# EAGLE schematic flight_controller_v1.0 (EAGLE 9.7.0)

## Sheet 1 of 6: Power regulation
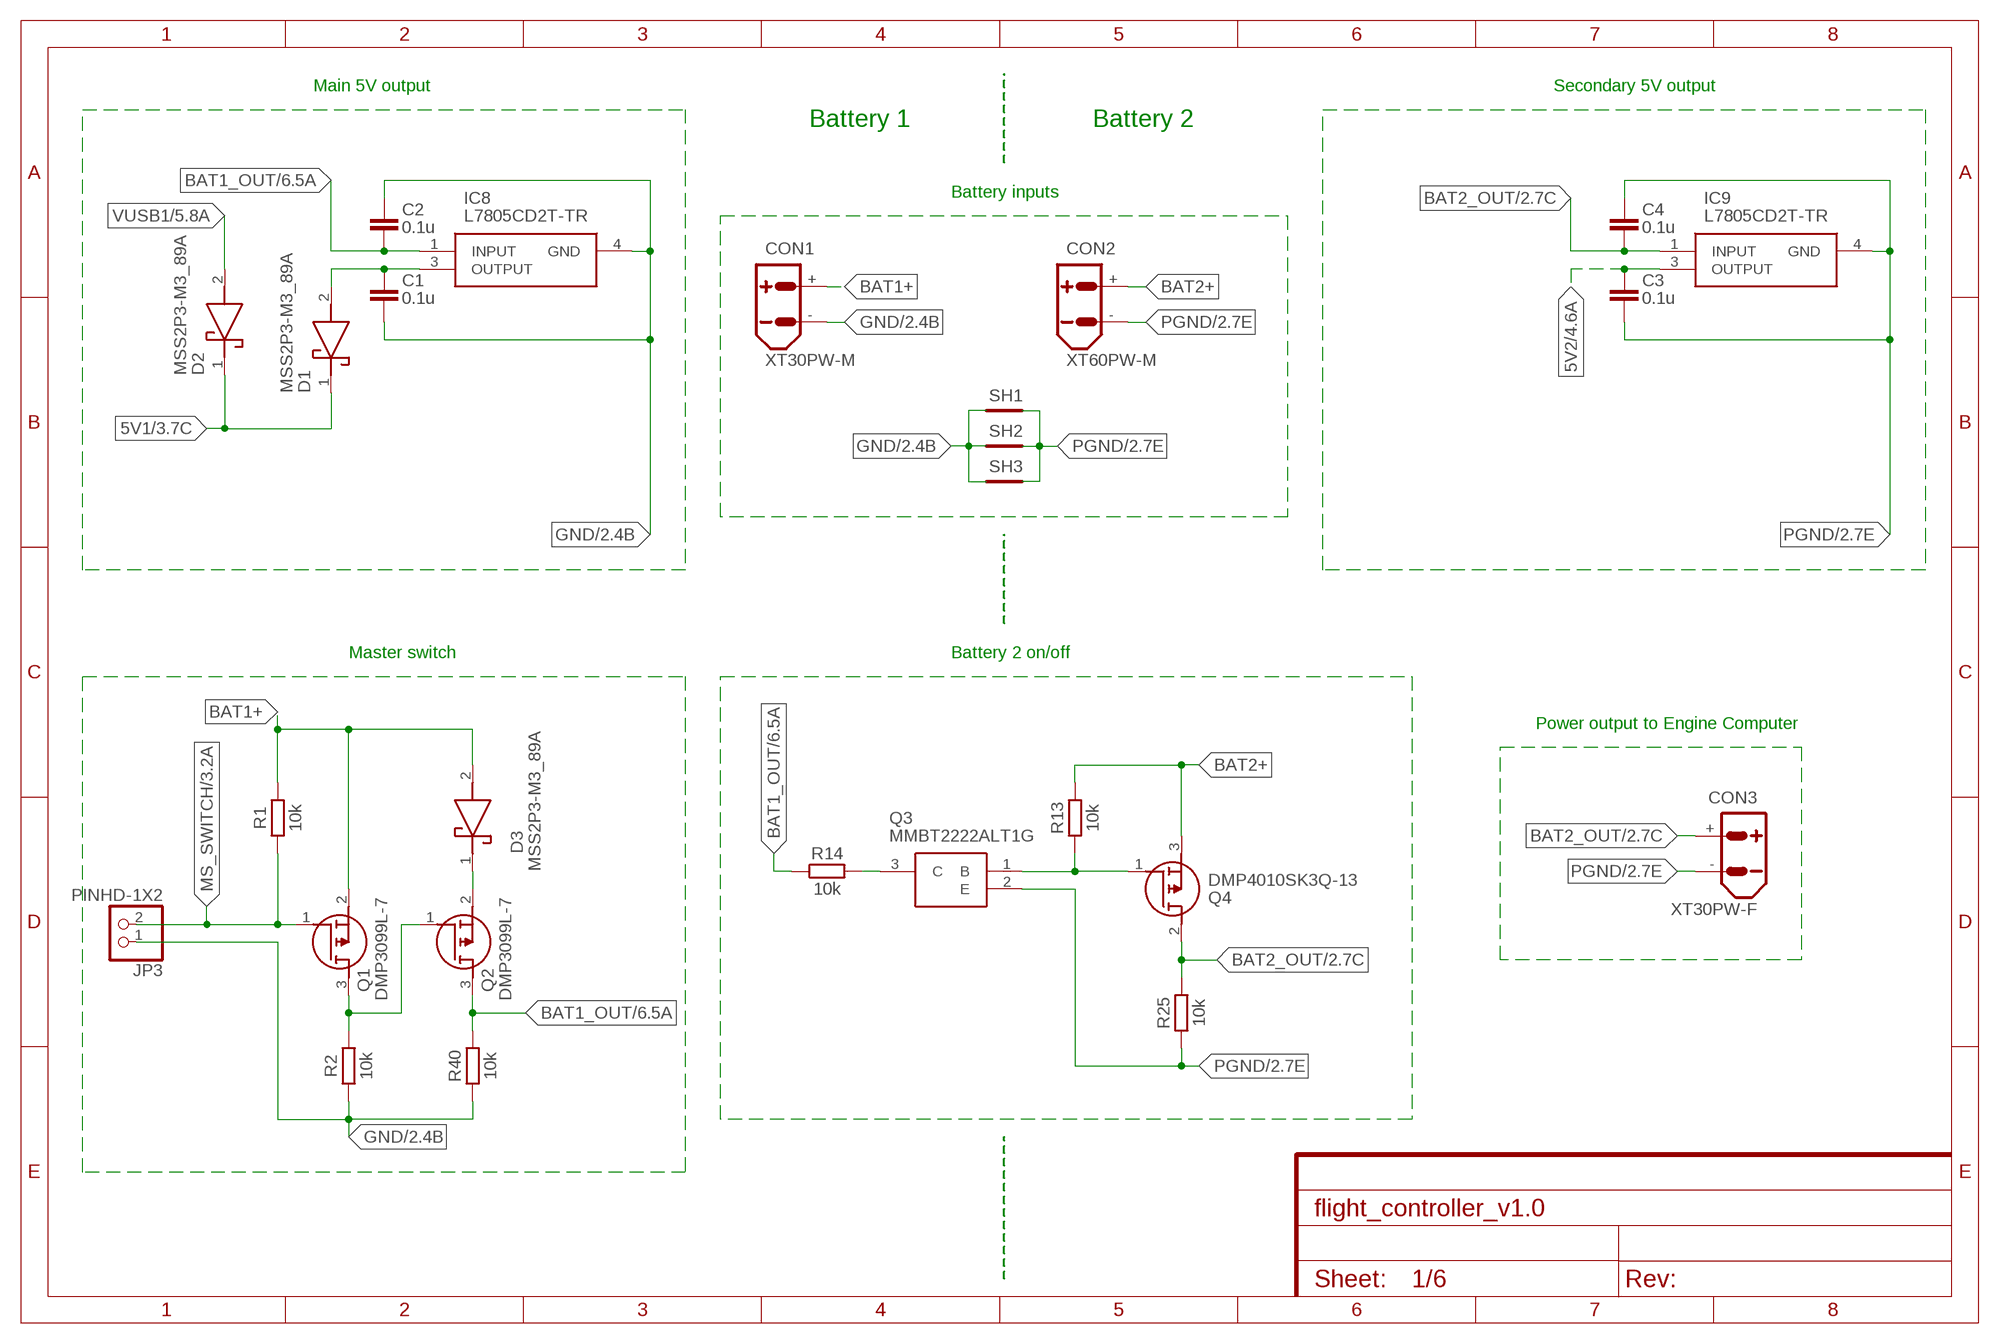
[diagram p0: schematic, sheet 1]

### Parts
C1  0.1u  C_CHIP-0805(2012-METRIC)  [CAPC2012X110]
C2  0.1u  C_CHIP-0805(2012-METRIC)  [CAPC2012X110]
C3  0.1u  C_CHIP-0805(2012-METRIC)  [CAPC2012X110]
C4  0.1u  C_CHIP-0805(2012-METRIC)  [CAPC2012X110]
CON1  XT30PW-M  [XT30PW-M]
CON2  XT60PW-M  [XT60PW-M]
CON3  XT30PW-F  [XT30PW-F]
D1  MSS2P3-M3_89A  [MSS2P3M389A]
D2  MSS2P3-M3_89A  [MSS2P3M389A]
D3  MSS2P3-M3_89A  [MSS2P3M389A]
IC8  L7805CD2T-TR  [TO254P1542X460-3N]
IC9  L7805CD2T-TR  [TO254P1542X460-3N]
JP3  PINHD-1X2  [1X02]
Q1  DMP3099L-7  [SOT96P240X120-3N]
Q2  DMP3099L-7  [SOT96P240X120-3N]
Q3  MMBT2222ALT1G  [SOT96P237X111-3N]
Q4  DMP4010SK3Q-13  [SBR6100CTL13]
R1  10k  R_CHIP-0805(2012-METRIC)  [RESC2012X65]
R2  10k  R_CHIP-0805(2012-METRIC)  [RESC2012X65]
R13  10k  R_CHIP-0805(2012-METRIC)  [RESC2012X65]
R14  10k  R_CHIP-0805(2012-METRIC)  [RESC2012X65]
R25  10k  R_CHIP-0805(2012-METRIC)  [RESC2012X65]
R40  10k  R_CHIP-0805(2012-METRIC)  [RESC2012X65]
SH1  SHORT-HT5  [SHORT_TOP-50]
SH2  SHORT-HT5  [SHORT_TOP-50]
SH3  SHORT-HT5  [SHORT_TOP-50]

### Nets
5V1: D1.1(K) D2.1(K) ; also sheet 3,5,6
5V2: C3.1 IC9.3(OUTPUT) ; also sheet 4,5
BAT1+: CON1.+ D3.2(A) Q1.2(S) R1.2
BAT1_OUT: C2.2 IC8.1(INPUT) Q2.3(D) R14.1 R40.2 ; also sheet 6
BAT2+: CON2.+ Q4.3(S) R13.2
BAT2_OUT: C4.2 CON3.+ IC9.1(INPUT) Q4.2(D) R25.2 ; also sheet 2,4,6
GND: C1.2 C2.1 CON1.- IC8.4(GND) JP3.1 R2.1 R40.1 SH1.1 SH2.1 SH3.1 ; also sheet 2,3,4,5,6
MS_SWITCH: JP3.2 Q1.1(G) R1.1 ; also sheet 3
N$6: Q1.3(D) Q2.1(G) R2.2
N$8: Q3.1(B) Q4.1(G) R13.1
N$19: Q3.3(C) R14.2
N$39: C1.1 D1.2(A) IC8.3(OUTPUT)
N$54: D3.1(K) Q2.2(S)
PGND: C3.2 C4.1 CON2.- CON3.- IC9.4(GND) Q3.2(E) R25.1 SH1.2 SH2.2 SH3.2 ; also sheet 2,4,5
VUSB1: D2.2(A) ; also sheet 5

### Notes on the sheet
- Main 5V output | Secondary 5V output
- Battery 1 | Battery 2
- Battery inputs
- Master switch | Battery 2 on/off
- Power output to Engine Computer

## Sheet 2 of 6: Parachute output
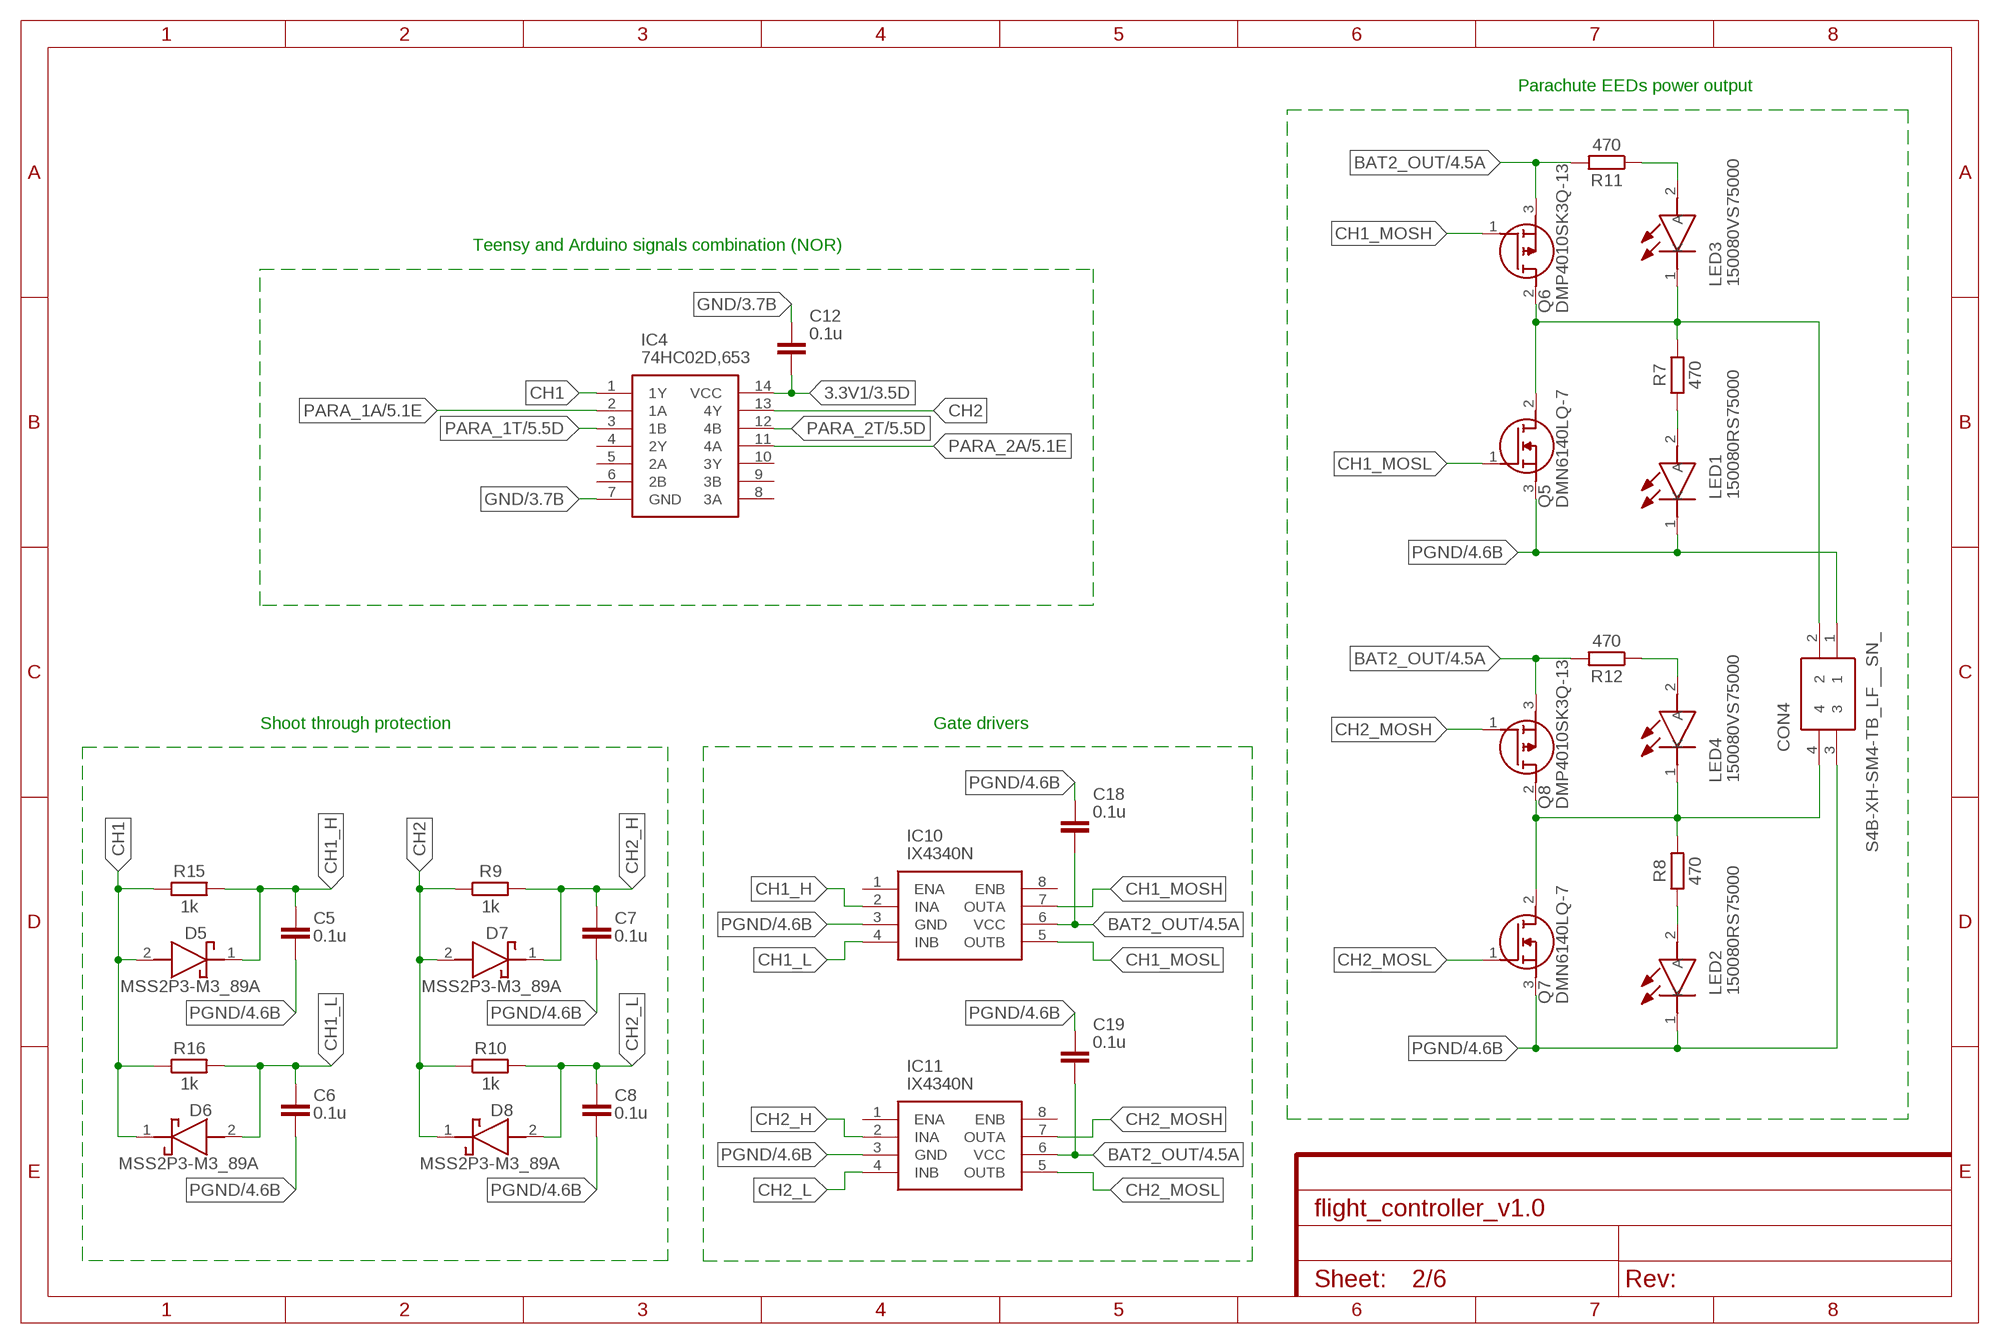
[diagram p1: schematic, sheet 2]

### Parts
C5  0.1u  C_CHIP-0805(2012-METRIC)  [CAPC2012X110]
C6  0.1u  C_CHIP-0805(2012-METRIC)  [CAPC2012X110]
C7  0.1u  C_CHIP-0805(2012-METRIC)  [CAPC2012X110]
C8  0.1u  C_CHIP-0805(2012-METRIC)  [CAPC2012X110]
C12  0.1u  C_CHIP-0805(2012-METRIC)  [CAPC2012X110]
C18  0.1u  C_CHIP-0805(2012-METRIC)  [CAPC2012X110]
C19  0.1u  C_CHIP-0805(2012-METRIC)  [CAPC2012X110]
CON4  S4B-XH-SM4-TB_LF__SN_  [S4B-XH-SM4-TB]
D5  MSS2P3-M3_89A  [MSS2P3M389A]
D6  MSS2P3-M3_89A  [MSS2P3M389A]
D7  MSS2P3-M3_89A  [MSS2P3M389A]
D8  MSS2P3-M3_89A  [MSS2P3M389A]
IC4  74HC02D,653  [SOIC127P600X175-14N]
IC10  IX4340N  [SOIC127P600X175-8N]
IC11  IX4340N  [SOIC127P600X175-8N]
LED1  150080RS75000  [LEDC2012X80N]
LED2  150080RS75000  [LEDC2012X80N]
LED3  150080VS75000  [LEDC2012X80N]
LED4  150080VS75000  [LEDC2012X80N]
Q5  DMN6140LQ-7  [SOT96P240X110-3N]
Q6  DMP4010SK3Q-13  [SBR6100CTL13]
Q7  DMN6140LQ-7  [SOT96P240X110-3N]
Q8  DMP4010SK3Q-13  [SBR6100CTL13]
R7  470  R_CHIP-0805(2012-METRIC)  [RESC2012X65]
R8  470  R_CHIP-0805(2012-METRIC)  [RESC2012X65]
R9  1k  R_CHIP-0805(2012-METRIC)  [RESC2012X65]
R10  1k  R_CHIP-0805(2012-METRIC)  [RESC2012X65]
R11  470  R_CHIP-0805(2012-METRIC)  [RESC2012X65]
R12  470  R_CHIP-0805(2012-METRIC)  [RESC2012X65]
R15  1k  R_CHIP-0805(2012-METRIC)  [RESC2012X65]
R16  1k  R_CHIP-0805(2012-METRIC)  [RESC2012X65]

### Nets
3.3V1: C12.2 IC4.14(VCC) ; also sheet 3,4,5,6
BAT2_OUT: C18.2 C19.2 IC10.6(VCC) IC11.6(VCC) Q6.3(S) Q8.3(S) R11.2 R12.2 ; also sheet 1,4,6
CH1: D5.2(A) D6.1(K) IC4.1(1Y) R15.1 R16.1
CH1_H: C5.1 D5.1(K) IC10.2(INA) R15.2
CH1_L: C6.1 D6.2(A) IC10.4(INB) R16.2
CH1_MOSH: IC10.7(OUTA) Q6.1(G)
CH1_MOSL: IC10.5(OUTB) Q5.1(G)
CH2: D7.2(A) D8.1(K) IC4.13(4Y) R9.1 R10.1
CH2_H: C7.1 D7.1(K) IC11.2(INA) R9.2
CH2_L: C8.1 D8.2(A) IC11.4(INB) R10.2
CH2_MOSH: IC11.7(OUTA) Q8.1(G)
CH2_MOSL: IC11.5(OUTB) Q7.1(G)
GND: C12.1 IC4.7(GND) ; also sheet 1,3,4,5,6
N$10: CON4.2 LED3.1(K) Q5.2(D) Q6.2(D) R7.2
N$11: LED1.2(A) R7.1
N$14: CON4.4 LED4.1(K) Q7.2(D) Q8.2(D) R8.2
N$16: LED2.2(A) R8.1
N$26: LED3.2(A) R11.1
N$28: LED4.2(A) R12.1
PARA_1A: IC4.2(1A) ; also sheet 5
PARA_1T: IC4.3(1B) ; also sheet 5
PARA_2A: IC4.11(4A) ; also sheet 5
PARA_2T: IC4.12(4B) ; also sheet 5
PGND: C5.2 C6.2 C7.2 C8.2 C18.1 C19.1 CON4.1 CON4.3 IC10.3(GND) IC11.3(GND) LED1.1(K) LED2.1(K) Q5.3(S) Q7.3(S) ; also sheet 1,4,5
Unconnected: IC4.4(2Y) IC4.5(2A) IC4.6(2B) IC4.8(3A) IC4.9(3B) IC4.10(3Y) IC10.1(ENA) IC10.8(ENB) IC11.1(ENA) IC11.8(ENB)

### Notes on the sheet
- Parachute EEDs power output
- Teensy and Arduino signals combination (NOR)
- Shoot through protection | Gate drivers

## Sheet 3 of 6: I/O connectors 1
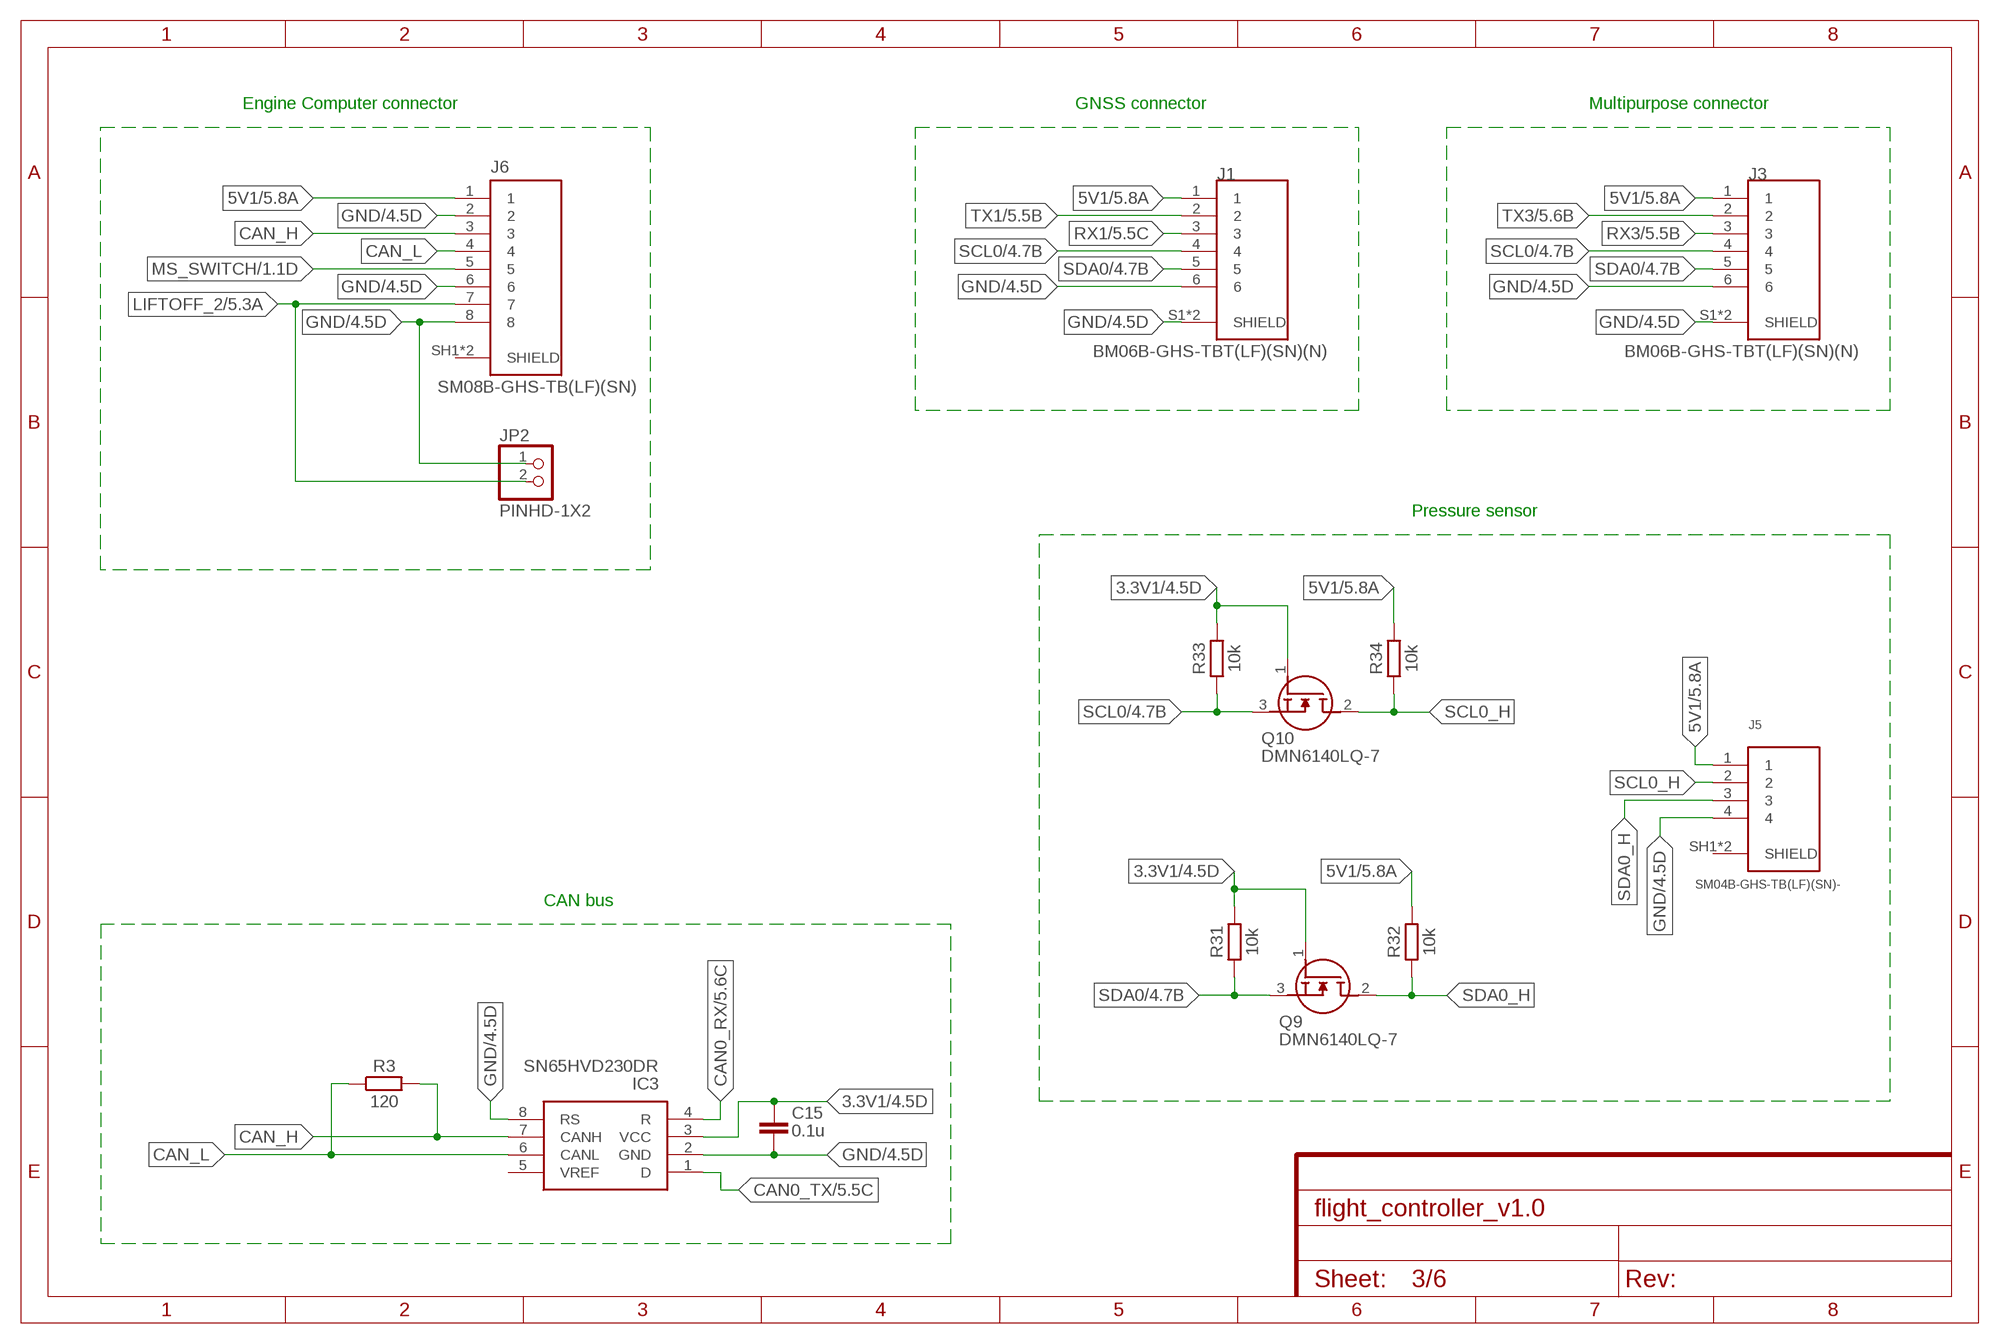
[diagram p2: schematic, sheet 3]

### Parts
C15  0.1u  C_CHIP-0805(2012-METRIC)  [CAPC2012X110]
IC3  SN65HVD230DR  [SOT127P600X175-8N]
J1  BM06B-GHS-TBT(LF)(SN)(N)  [JST_BM06B-GHS-TBT(LF)(SN)(N)]
J3  BM06B-GHS-TBT(LF)(SN)(N)  [JST_BM06B-GHS-TBT(LF)(SN)(N)]
J5  SM04B-GHS-TB(LF)(SN)-  [JST_SM04B-GHS-TB(LF)(SN)-]
J6  SM08B-GHS-TB(LF)(SN)  [JST_SM08B-GHS-TB(LF)(SN)]
JP2  PINHD-1X2  [1X02]
Q9  DMN6140LQ-7  [SOT96P240X110-3N]
Q10  DMN6140LQ-7  [SOT96P240X110-3N]
R3  120  R_CHIP-0805(2012-METRIC)  [RESC2012X65]
R31  10k  R_CHIP-0805(2012-METRIC)  [RESC2012X65]
R32  10k  R_CHIP-0805(2012-METRIC)  [RESC2012X65]
R33  10k  R_CHIP-0805(2012-METRIC)  [RESC2012X65]
R34  10k  R_CHIP-0805(2012-METRIC)  [RESC2012X65]

### Nets
3.3V1: C15.1 IC3.3(VCC) Q9.1(G) Q10.1(G) R31.2 R33.2 ; also sheet 2,4,5,6
5V1: J1.1 J3.1 J5.1 J6.1 R32.2 R34.2 ; also sheet 1,5,6
CAN0_RX: IC3.4(R) ; also sheet 5
CAN0_TX: IC3.1(D) ; also sheet 5
CAN_H: IC3.7(CANH) J6.3 R3.2
CAN_L: IC3.6(CANL) J6.4 R3.1
GND: C15.2 IC3.2(GND) IC3.8(RS) J1.6 J1.S1(SHIELD) J1.S2(SHIELD) J3.6 J3.S1(SHIELD) J3.S2(SHIELD) J5.4 J6.2 J6.6 J6.8 JP2.1 ; also sheet 1,2,4,5,6
LIFTOFF_2: J6.7 JP2.2 ; also sheet 5
MS_SWITCH: J6.5 ; also sheet 1
RX1: J1.3 ; also sheet 5
RX3: J3.3 ; also sheet 5
SCL0: J1.4 J3.4 Q10.3(S) R33.1 ; also sheet 4,5
SCL0_H: J5.2 Q10.2(D) R34.1
SDA0: J1.5 J3.5 Q9.3(S) R31.1 ; also sheet 4,5
SDA0_H: J5.3 Q9.2(D) R32.1
TX1: J1.2 ; also sheet 5
TX3: J3.2 ; also sheet 5
Unconnected: IC3.5(VREF) J6.SH1(SHIELD) J6.SH2(SHIELD)

### Notes on the sheet
- Engine Computer connector | GNSS connector | Multipurpose connector
- Pressure sensor
- CAN bus

## Sheet 4 of 6: I/O connectors 2
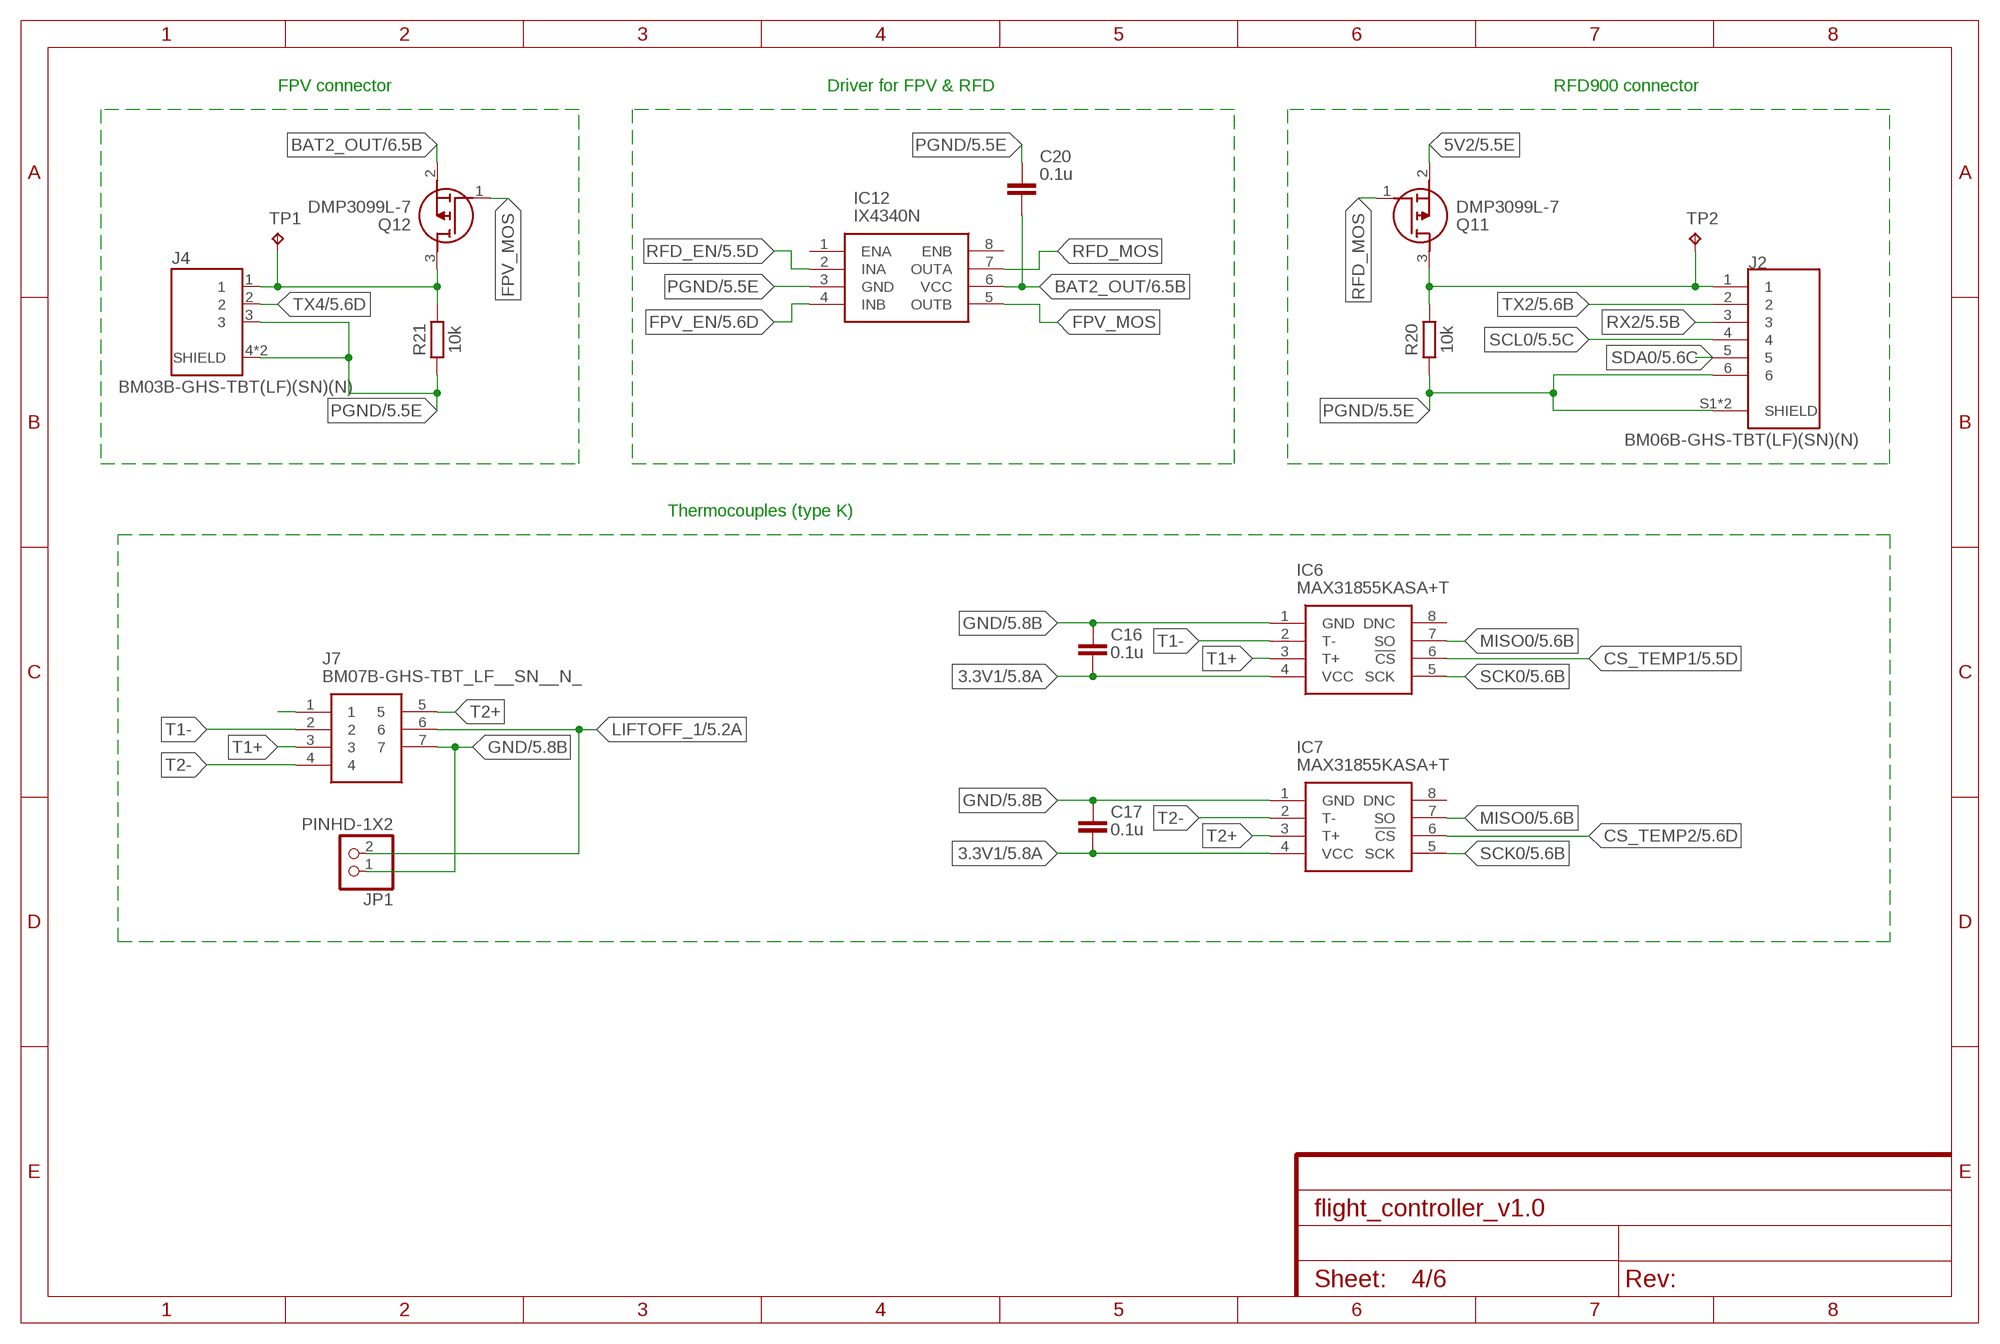
[diagram p3: schematic, sheet 4]

### Parts
C16  0.1u  C_CHIP-0805(2012-METRIC)  [CAPC2012X110]
C17  0.1u  C_CHIP-0805(2012-METRIC)  [CAPC2012X110]
C20  0.1u  C_CHIP-0805(2012-METRIC)  [CAPC2012X110]
IC6  MAX31855KASA+T  [SOIC127P600X175-8N]
IC7  MAX31855KASA+T  [SOIC127P600X175-8N]
IC12  IX4340N  [SOIC127P600X175-8N]
J2  BM06B-GHS-TBT(LF)(SN)(N)  [JST_BM06B-GHS-TBT(LF)(SN)(N)]
J4  BM03B-GHS-TBT(LF)(SN)(N)  [CONN_BM03B-GHS-TBT(LF)(SN)(N)]
J7  BM07B-GHS-TBT_LF__SN__N_  [BM07B-GHS-TBT]
JP1  PINHD-1X2  [1X02]
Q11  DMP3099L-7  [SOT96P240X120-3N]
Q12  DMP3099L-7  [SOT96P240X120-3N]
R20  10k  R_CHIP-0805(2012-METRIC)  [RESC2012X65]
R21  10k  R_CHIP-0805(2012-METRIC)  [RESC2012X65]
TP1  TPB1,27  [B1,27]
TP2  TPB1,27  [B1,27]

### Nets
3.3V1: C16.2 C17.2 IC6.4(VCC) IC7.4(VCC) ; also sheet 2,3,5,6
5V2: Q11.2(S) ; also sheet 1,5
BAT2_OUT: C20.2 IC12.6(VCC) Q12.2(S) ; also sheet 1,2,6
CS_TEMP1: IC6.6(!CS) ; also sheet 5
CS_TEMP2: IC7.6(!CS) ; also sheet 5
FPV_EN: IC12.4(INB) ; also sheet 5
FPV_MOS: IC12.5(OUTB) Q12.1(G)
GND: C16.1 C17.1 IC6.1(GND) IC7.1(GND) J7.7 JP1.1 ; also sheet 1,2,3,5,6
LIFTOFF_1: J7.6 JP1.2 ; also sheet 5
MISO0: IC6.7(SO) IC7.7(SO) ; also sheet 5,6
N$32: J2.1 Q11.3(D) R20.2 TP2.TP
N$35: J4.1 Q12.3(D) R21.2 TP1.TP
N$42: J7.1
PGND: C20.1 IC12.3(GND) J2.6 J2.S1(SHIELD) J2.S2(SHIELD) J4.3 J4.4(SHIELD) J4.5(SHIELD) R20.1 R21.1 ; also sheet 1,2,5
RFD_EN: IC12.2(INA) ; also sheet 5
RFD_MOS: IC12.7(OUTA) Q11.1(G)
RX2: J2.3 ; also sheet 5
SCK0: IC6.5(SCK) IC7.5(SCK) ; also sheet 5,6
SCL0: J2.4 ; also sheet 3,5
SDA0: J2.5 ; also sheet 3,5
T1+: IC6.3(T+) J7.3
T1-: IC6.2(T-) J7.2
T2+: IC7.3(T+) J7.5
T2-: IC7.2(T-) J7.4
TX2: J2.2 ; also sheet 5
TX4: J4.2 ; also sheet 5
Unconnected: IC6.8(DNC) IC7.8(DNC) IC12.1(ENA) IC12.8(ENB)

### Notes on the sheet
- FPV connector | Driver for FPV & RFD | RFD900 connector
- Thermocouples (type K)

## Sheet 5 of 6: MCUs
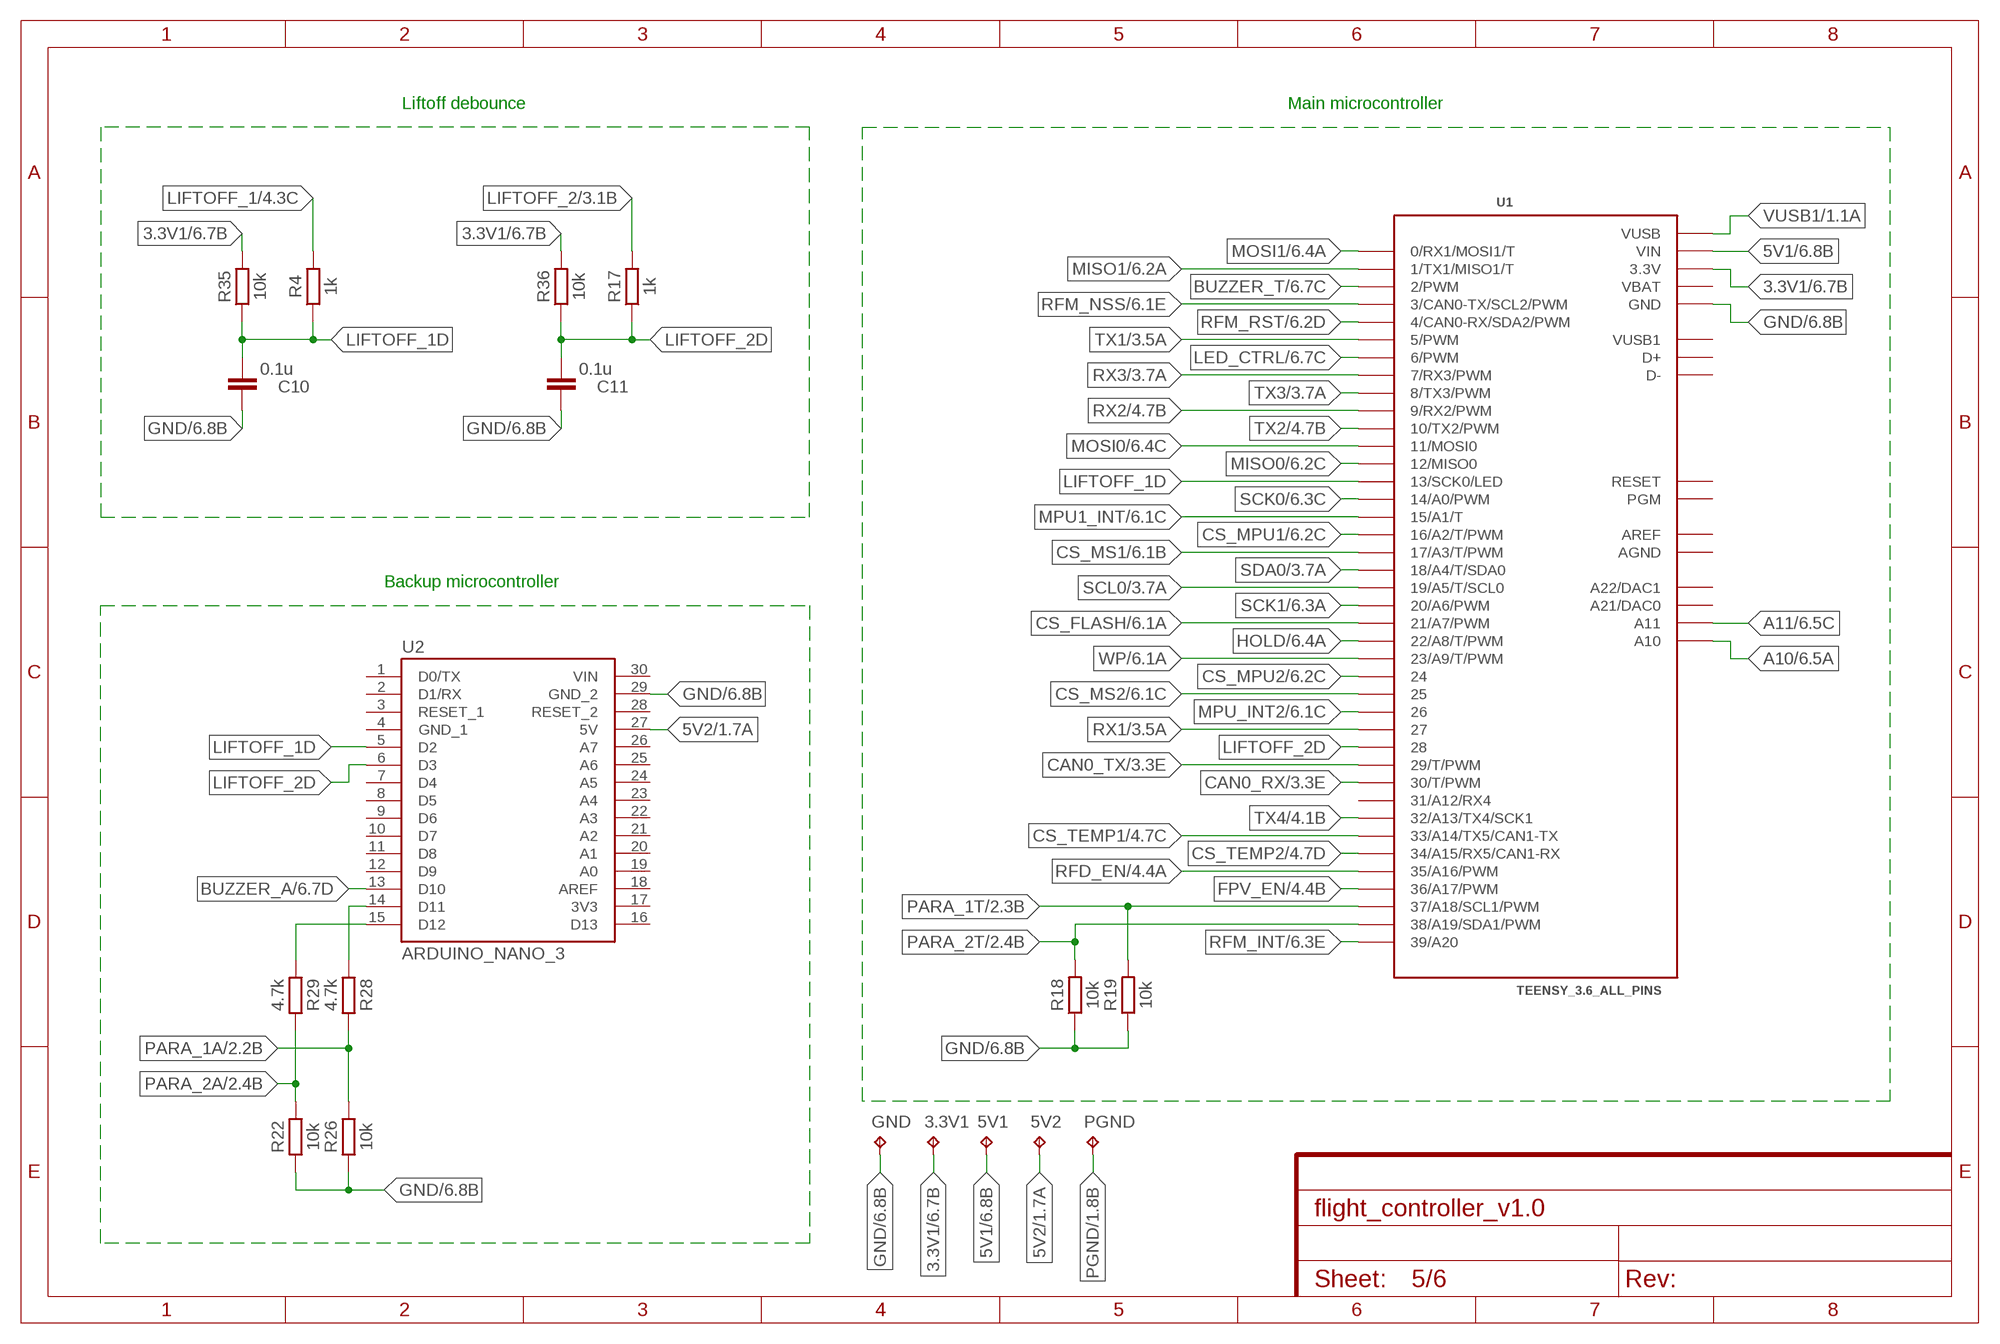
[diagram p4: schematic, sheet 5]

### Parts
3.3V1  TPB1,27  [B1,27]
5V1  TPB1,27  [B1,27]
5V2  TPB1,27  [B1,27]
C10  0.1u  C_CHIP-0805(2012-METRIC)  [CAPC2012X110]
C11  0.1u  C_CHIP-0805(2012-METRIC)  [CAPC2012X110]
GND  TPB1,27  [B1,27]
PGND  TPB1,27  [B1,27]
R4  1k  R_CHIP-0805(2012-METRIC)  [RESC2012X65]
R17  1k  R_CHIP-0805(2012-METRIC)  [RESC2012X65]
R18  10k  R_CHIP-0805(2012-METRIC)  [RESC2012X65]
R19  10k  R_CHIP-0805(2012-METRIC)  [RESC2012X65]
R22  10k  R_CHIP-0805(2012-METRIC)  [RESC2012X65]
R26  10k  R_CHIP-0805(2012-METRIC)  [RESC2012X65]
R28  4.7k  R_CHIP-0805(2012-METRIC)  [RESC2012X65]
R29  4.7k  R_CHIP-0805(2012-METRIC)  [RESC2012X65]
R35  10k  R_CHIP-0805(2012-METRIC)  [RESC2012X65]
R36  10k  R_CHIP-0805(2012-METRIC)  [RESC2012X65]
U1  TEENSY_3.6_ALL_PINS  [TEENSY_3.6_ALL_PINS]
U2  ARDUINO_NANO_3  [MODULE_A000005]

### Nets
3.3V1: 3.3V1.TP R35.2 R36.2 U1.3.3V U1.3.3V3(3.3V) U1.3.3V4(3.3V) ; also sheet 2,3,4,6
5V1: 5V1.TP U1.VIN ; also sheet 1,3,6
5V2: 5V2.TP U2.27(5V) ; also sheet 1,4
A10: U1.A10 ; also sheet 6
A11: U1.A11 ; also sheet 6
BUZZER_A: U2.13(D10) ; also sheet 6
BUZZER_T: U1.2(2/PWM) ; also sheet 6
CAN0_RX: U1.30(30/T/PWM) ; also sheet 3
CAN0_TX: U1.29(29/T/PWM) ; also sheet 3
CS_FLASH: U1.21/A7(21/A7/PWM) ; also sheet 6
CS_MPU1: U1.16/A2(16/A2/T/PWM) ; also sheet 6
CS_MPU2: U1.24 ; also sheet 6
CS_MS1: U1.17/A3(17/A3/T/PWM) ; also sheet 6
CS_MS2: U1.25 ; also sheet 6
CS_TEMP1: U1.33/A14(33/A14/TX5/CAN1-TX) ; also sheet 4
CS_TEMP2: U1.34/A15(34/A15/RX5/CAN1-RX) ; also sheet 4
FPV_EN: U1.36/A17(36/A17/PWM) ; also sheet 4
GND: C10.2 C11.2 GND.TP R18.1 R19.1 R22.1 R26.1 U1.GND U1.GND1(GND) U1.GND3(GND) U1.GND4(GND) U1.GND6(GND) U2.29(GND_2) ; also sheet 1,2,3,4,6
HOLD: U1.22/A8(22/A8/T/PWM) ; also sheet 6
LED_CTRL: U1.6(6/PWM) ; also sheet 6
LIFTOFF_1: R4.2 ; also sheet 4
LIFTOFF_1D: C10.1 R4.1 R35.1 U1.13(13/SCK0/LED) U2.5(D2)
LIFTOFF_2: R17.2 ; also sheet 3
LIFTOFF_2D: C11.1 R17.1 R36.1 U1.28 U2.6(D3)
MISO0: U1.12(12/MISO0) ; also sheet 4,6
MISO1: U1.1(1/TX1/MISO1/T) ; also sheet 6
MOSI0: U1.11(11/MOSI0) ; also sheet 6
MOSI1: U1.0(0/RX1/MOSI1/T) ; also sheet 6
MPU1_INT: U1.15/A1(15/A1/T) ; also sheet 6
MPU_INT2: U1.26 ; also sheet 6
N$45: R28.1 U2.14(D11)
N$46: R29.1 U2.15(D12)
PARA_1A: R26.2 R28.2 ; also sheet 2
PARA_1T: R19.2 U1.37/A18(37/A18/SCL1/PWM) ; also sheet 2
PARA_2A: R22.2 R29.2 ; also sheet 2
PARA_2T: R18.2 U1.38/A19(38/A19/SDA1/PWM) ; also sheet 2
PGND: PGND.TP ; also sheet 1,2,4
RFD_EN: U1.35/A16(35/A16/PWM) ; also sheet 4
RFM_INT: U1.39/A20 ; also sheet 6
RFM_NSS: U1.3(3/CAN0-TX/SCL2/PWM) ; also sheet 6
RFM_RST: U1.4(4/CAN0-RX/SDA2/PWM) ; also sheet 6
RX1: U1.27 ; also sheet 3
RX2: U1.9(9/RX2/PWM) ; also sheet 4
RX3: U1.7(7/RX3/PWM) ; also sheet 3
SCK0: U1.14/A0(14/A0/PWM) ; also sheet 4,6
SCK1: U1.20/A6(20/A6/PWM) ; also sheet 6
SCL0: U1.19/A5(19/A5/T/SCL0) ; also sheet 3,4
SDA0: U1.18/A4(18/A4/T/SDA0) ; also sheet 3,4
TX1: U1.5(5/PWM) ; also sheet 3
TX2: U1.10(10/TX2/PWM) ; also sheet 4
TX3: U1.8(8/TX3/PWM) ; also sheet 3
TX4: U1.32/A13(32/A13/TX4/SCK1) ; also sheet 4
VUSB1: U1.VUSB ; also sheet 1
WP: U1.23/A9(23/A9/T/PWM) ; also sheet 6
Unconnected: U1.31/A12(31/A12/RX4) U1.A21(A21/DAC0) U1.A22(A22/DAC1) U1.D+ U1.D- U1.PGM U1.RESET U2.1(D0/TX) U2.2(D1/RX) U2.3(RESET_1) U2.7(D4) U2.8(D5) U2.9(D6) U2.10(D7) U2.11(D8) U2.12(D9) U2.16(D13) U2.18(AREF) U2.19(A0) U2.20(A1) U2.21(A2) U2.22(A3) U2.23(A4) U2.24(A5) U2.25(A6) U2.26(A7) U2.28(RESET_2)

### Notes on the sheet
- Liftoff debounce | Main microcontroller
- Backup microcontroller

## Sheet 6 of 6: RF, memory, on-board sensors
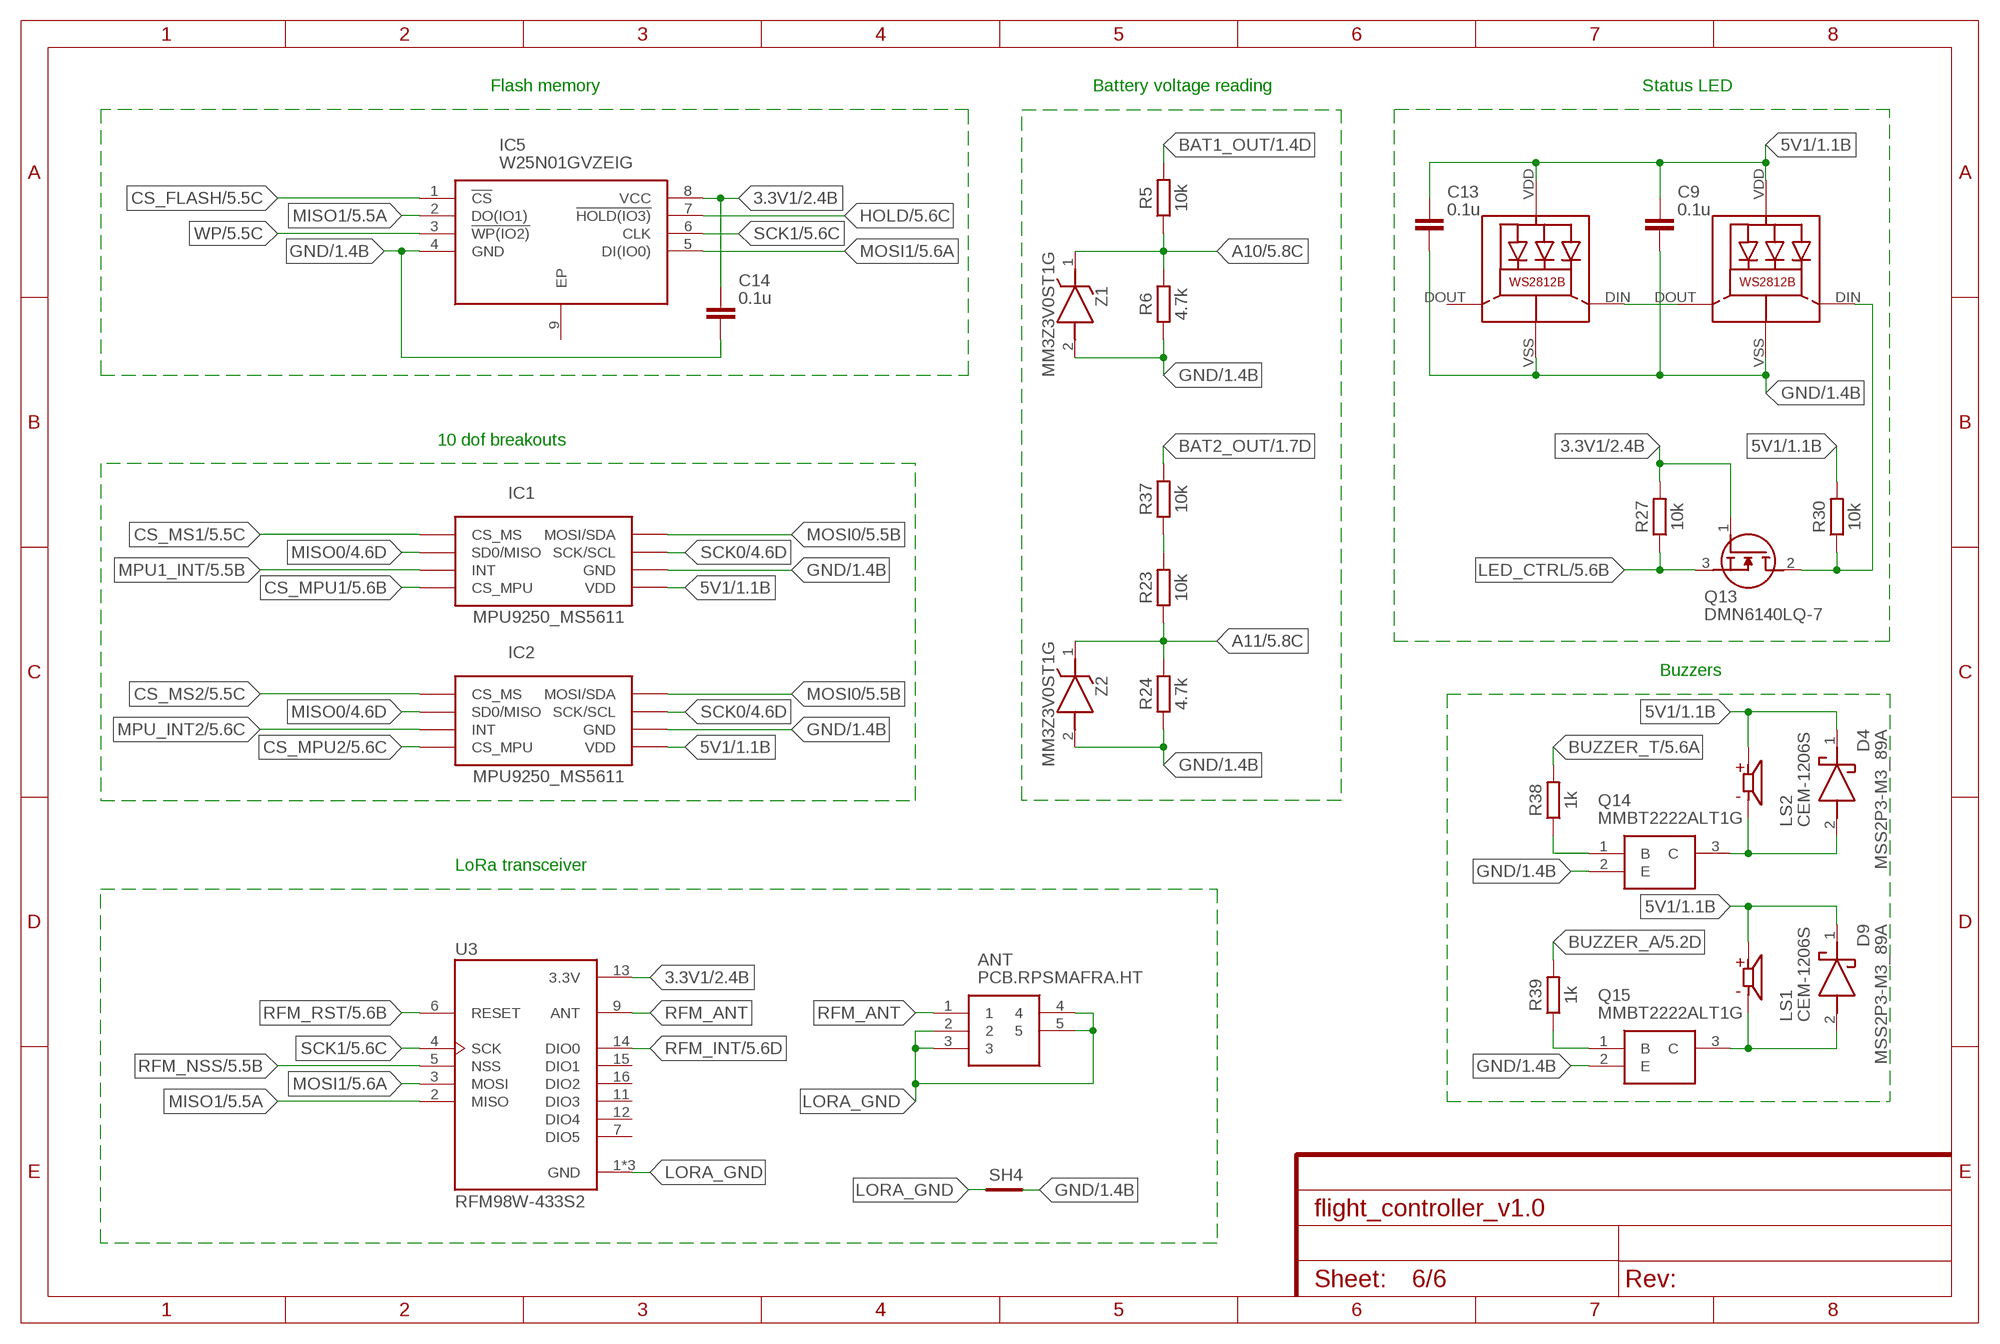
[diagram p5: schematic, sheet 6]

### Parts
ANT  PCB.RPSMAFRA.HT  [PCBRPSMAFRAHT]
C9  0.1u  C_CHIP-0805(2012-METRIC)  [CAPC2012X110]
C13  0.1u  C_CHIP-0805(2012-METRIC)  [CAPC2012X110]
C14  0.1u  C_CHIP-0805(2012-METRIC)  [CAPC2012X110]
D4  MSS2P3-M3_89A  [MSS2P3M389A]
D9  MSS2P3-M3_89A  [MSS2P3M389A]
IC1  MPU9250_MS5611  [2X4PIN]
IC2  MPU9250_MS5611  [2X4PIN]
IC5  W25N01GVZEIG  [SON127P800X600X80-9N]
LED5  WS2812B  [WS2812B]
LED6  WS2812B  [WS2812B]
LS1  CEM-1206S  [CUI_CEM-1206S]
LS2  CEM-1206S  [CUI_CEM-1206S]
Q13  DMN6140LQ-7  [SOT96P240X110-3N]
Q14  MMBT2222ALT1G  [SOT96P237X111-3N]
Q15  MMBT2222ALT1G  [SOT96P237X111-3N]
R5  10k  R_CHIP-0805(2012-METRIC)  [RESC2012X65]
R6  4.7k  R_CHIP-0805(2012-METRIC)  [RESC2012X65]
R23  10k  R_CHIP-0805(2012-METRIC)  [RESC2012X65]
R24  4.7k  R_CHIP-0805(2012-METRIC)  [RESC2012X65]
R27  10k  R_CHIP-0805(2012-METRIC)  [RESC2012X65]
R30  10k  R_CHIP-0805(2012-METRIC)  [RESC2012X65]
R37  10k  R_CHIP-0805(2012-METRIC)  [RESC2012X65]
R38  1k  R_CHIP-0805(2012-METRIC)  [RESC2012X65]
R39  1k  R_CHIP-0805(2012-METRIC)  [RESC2012X65]
SH4  SHORT-HT5  [SHORT_TOP-50]
U3  RFM98W-433S2  [XCVR_RFM98W-433S2]
Z1  MM3Z3V0ST1G  [SOD2512X110N]
Z2  MM3Z3V0ST1G  [SOD2512X110N]

### Nets
3.3V1: C14.1 IC5.8(VCC) Q13.1(G) R27.2 U3.13(3.3V) ; also sheet 2,3,4,5
5V1: C9.1 C13.1 D4.1(K) D9.1(K) IC1.P$5(VDD) IC2.P$5(VDD) LED5.VDD LED6.VDD LS1.P LS2.P R30.2 ; also sheet 1,3,5
A10: R5.1 R6.2 Z1.1(K) ; also sheet 5
A11: R23.1 R24.2 Z2.1(K) ; also sheet 5
BAT1_OUT: R5.2 ; also sheet 1
BAT2_OUT: R37.2 ; also sheet 1,2,4
BUZZER_A: R39.2 ; also sheet 5
BUZZER_T: R38.2 ; also sheet 5
CS_FLASH: IC5.1(!CS) ; also sheet 5
CS_MPU1: IC1.P$4(CS_MPU) ; also sheet 5
CS_MPU2: IC2.P$4(CS_MPU) ; also sheet 5
CS_MS1: IC1.P$1(CS_MS) ; also sheet 5
CS_MS2: IC2.P$1(CS_MS) ; also sheet 5
GND: C9.2 C13.2 C14.2 IC1.P$6(GND) IC2.P$6(GND) IC5.4(GND) LED5.VSS(GND) LED6.VSS(GND) Q14.2(E) Q15.2(E) R6.1 R24.1 SH4.2 Z1.2(A) Z2.2(A) ; also sheet 1,2,3,4,5
HOLD: IC5.7(!HOLD(IO3)) ; also sheet 5
LED_CTRL: Q13.3(S) R27.1 ; also sheet 5
LORA_GND: ANT.2 ANT.3 ANT.4 ANT.5 SH4.1 U3.1(GND) U3.8(GND) U3.10(GND)
MISO0: IC1.P$2(SD0/MISO) IC2.P$2(SD0/MISO) ; also sheet 4,5
MISO1: IC5.2(DO(IO1)) U3.2(MISO) ; also sheet 5
MOSI0: IC1.P$8(MOSI/SDA) IC2.P$8(MOSI/SDA) ; also sheet 5
MOSI1: IC5.5(DI(IO0)) U3.3(MOSI) ; also sheet 5
MPU1_INT: IC1.P$3(INT) ; also sheet 5
MPU_INT2: IC2.P$3(INT) ; also sheet 5
N$1: LED5.DOUT(DO) LED6.DIN(DI)
N$44: LED5.DIN(DI) Q13.2(D) R30.1
N$48: R23.2 R37.1
N$49: D4.2(A) LS2.N Q14.3(C)
N$50: Q14.1(B) R38.1
N$51: D9.2(A) LS1.N Q15.3(C)
N$52: Q15.1(B) R39.1
RFM_ANT: ANT.1 U3.9(ANT)
RFM_INT: U3.14(DIO0) ; also sheet 5
RFM_NSS: U3.5(NSS) ; also sheet 5
RFM_RST: U3.6(RESET) ; also sheet 5
SCK0: IC1.P$7(SCK/SCL) IC2.P$7(SCK/SCL) ; also sheet 4,5
SCK1: IC5.6(CLK) U3.4(SCK) ; also sheet 5
WP: IC5.3(!WP(IO2)) ; also sheet 5
Unconnected: IC5.9(EP) LED6.DOUT(DO) U3.7(DIO5) U3.11(DIO3) U3.12(DIO4) U3.15(DIO1) U3.16(DIO2)

### Notes on the sheet
- Flash memory | Battery voltage reading | Status LED
- 10 dof breakouts
- Buzzers
- LoRa transceiver

## Power pins joined to a net without a drawn wire
3V3: U2.17(3V3)
AGND: U1.AGND
AREF: U1.AREF
GND_1: U2.4(GND_1)
SHIELD: J5.SH1(SHIELD) J5.SH2(SHIELD)
VBAT: U1.VBAT
VIN: U2.30(VIN)
VUSB1: U1.VUSB1

## Library data of the parts
3.3V1 5V1 5V2 GND PGND TP1 TP2 = testpad:TP: Test pad
ANT = PCB.RPSMAFRA.HT:PCB.RPSMAFRA.HT: RF Connectors / Coaxial Connectors SMA RA Reverse Polarity PCB Mount, Jack, Gold, 50 , Through Hole Pin Source: Datasheet <http://www.taoglas.com/wp-content/uploads/2016/01/PCB.RPSMAFRA.HT_.pdf>; DESCRIPTION: RF Connectors / Coaxial Connectors SMA RA Reverse Polarity PCB Mount, Jack, Gold, 50 , Through Hole Pin; HEIGHT: 7.4mm; MANUFACTURER_NAME: Taoglas; MANUFACTURER_PART_NUMBER: PCB.RPSMAFRA.HT; MOUSER_PART_NUMBER: 960-PCB.RPSMAFRA.HT; MOUSER_PRICE-STOCK: https://www.mouser.co.uk/ProductDetail/Taoglas/PCBRPSMAFRAHT?qs=RuW%2Fu%252BNMQmvVc2WiXpnkVw%3D%3D
C1-C20 = Capacitor:C: Capacitor - Generic; CATEGORY: Capacitor
CON1 CON3 = Amass connectors:XT30: AMASS XT30 connector Store in Japan AMASS XT30 connector <https://szc.jp/ams-xt30>
CON2 = Amass connectors:XT60: AMASS XT60 connector Store in Japan AMASS XT60 connector <https://szc.jp/ams-xt60>
CON4 = S4B-XH-SM4-TB_LF__SN_:S4B-XH-SM4-TB_LF__SN_: XH connector, SMT type shrouded header, 4-position Source: Datasheet <http://www.jst-mfg.com/product/pdf/eng/eXH.pdf>; DESCRIPTION: XH connector, SMT type shrouded header, 4-position; HEIGHT: mm; MANUFACTURER_NAME: JST (JAPAN SOLDERLESS TERMINALS); MANUFACTURER_PART_NUMBER: S4B-XH-SM4-TB(LF)(SN)
D1-D9 = MSS2P3-M3_89A:MSS2P3-M3_89A: Surface Mount Diode Schottky 30V 2A Micro SMP Vishay MSS2P3-M3/89A, SMT Schottky Diode, 30V 2A, 2-Pin uSMP Source: Datasheet <https://componentsearchengine.com/Datasheets/1/MSS2P3-M3_89A.pdf>; DESCRIPTION: Surface Mount Diode Schottky 30V 2A Micro SMP Vishay MSS2P3-M3/89A, SMT Schottky Diode, 30V 2A, 2-Pin uSMP; HEIGHT: 0.73mm; MANUFACTURER_NAME: Vishay; MANUFACTURER_PART_NUMBER: MSS2P3-M3/89A; MOUSER_PART_NUMBER: 625-MSS2P3-M3; MOUSER_PRICE-STOCK: https://www.mouser.com/Search/Refine.aspx?Keyword=625-MSS2P3-M3
IC1 IC2 = MPU9250_MS5611:MPU9250_MS5611
IC3 = SN65HVD230DR:SN65HVD230DR: 3.3 V CAN Transceiver with Standby Mode Source: Datasheet <http://www.ti.com/lit/gpn/sn65hvd230>; DESCRIPTION: 3.3 V CAN Transceiver with Standby Mode; HEIGHT: 1.75mm; MANUFACTURER_NAME: Texas Instruments; MANUFACTURER_PART_NUMBER: SN65HVD230DR; MOUSER_PART_NUMBER: 595-SN65HVD230DR; MOUSER_PRICE-STOCK: https://www.mouser.co.uk/ProductDetail/Texas-Instruments/SN65HVD230DR?qs=QViXGNcIEAtifeQR3pYVUQ%3D%3D
IC4 = 74HC02D_653:74HC02D,653: 74HC(T)02 - Quad 2-input NOR gate@en-us Source: Datasheet <https://assets.nexperia.com/documents/data-sheet/74HC_HCT02.pdf>; DESCRIPTION: 74HC(T)02 - Quad 2-input NOR gate@en-us; HEIGHT: 1.75mm; MANUFACTURER_NAME: Nexperia; MANUFACTURER_PART_NUMBER: 74HC02D,653; MOUSER_PART_NUMBER: 771-74HC02D-T; MOUSER_PRICE-STOCK: https://www.mouser.co.uk/ProductDetail/Nexperia/74HC02D653?qs=P62ublwmbi9%252BB%2Fa1jq%2FDZA%3D%3D
IC5 = W25N01GVZEIG:W25N01GVZEIG: 3V 1G-BITSERIAL SLC NAND FLASH MEMORY WITHDUAL/QUAD SPI/CONTINUOUS READ Source: Datasheet <https://www.arrow.com/en/products/w25n01gvzeig/winbond-electronics>; DESCRIPTION: 3V 1G-BITSERIAL SLC NAND FLASH MEMORY WITHDUAL/QUAD SPI/CONTINUOUS READ; HEIGHT: 0.8mm; MANUFACTURER_NAME: Winbond; MANUFACTURER_PART_NUMBER: W25N01GVZEIG; MOUSER_PART_NUMBER: 454-W25N01GVZEIG; MOUSER_PRICE-STOCK: https://www.mouser.co.uk/ProductDetail/Winbond/W25N01GVZEIG?qs=qSfuJ%252Bfl%2Fd6Vfx%252BkNMbzhw%3D%3D
IC6 IC7 = MAX31855KASA+T:MAX31855KASA+T: MAXIM INTEGRATED PRODUCTS - MAX31855KASA+T - TEMPERATURE SENSOR, 2DEG C, NSOIC-8 Source: Datasheet <https://datasheets.maximintegrated.com/en/ds/MAX31855.pdf>; DESCRIPTION: MAXIM INTEGRATED PRODUCTS - MAX31855KASA+T - TEMPERATURE SENSOR, 2DEG C, NSOIC-8; HEIGHT: 1.75mm; MANUFACTURER_NAME: Maxim Integrated; MANUFACTURER_PART_NUMBER: MAX31855KASA+T; MOUSER_PART_NUMBER: 700-MAX31855KASA+T; MOUSER_PRICE-STOCK: https://www.mouser.co.uk/ProductDetail/Maxim-Integrated/MAX31855KASA%2bT?qs=ffX8NcjNb2TujkrPyW1z%252Bg%3D%3D
IC8 IC9 = L7805CD2T-TR:L7805CD2T-TR: L7805CD2T-TR, Linear Voltage Regulator, 1.5A 5 V, 3-Pin D2PAK Source: Datasheet <http://www.st.com/web/en/resource/technical/document/datasheet/CD00000444.pdf>; ALLIED_NUMBER: 70390052; ALLIED_PRICE-STOCK: http://www.alliedelec.com/stmicroelectronics-l7805cd2t-tr/70390052/; DESCRIPTION: L7805CD2T-TR, Linear Voltage Regulator, 1.5A 5 V, 3-Pin D2PAK; HEIGHT: 4.6mm; MANUFACTURER_NAME: STMicroelectronics; MANUFACTURER_PART_NUMBER: L7805CD2T-TR; MOUSER_PART_NUMBER: 511-L7805CD2T-TR; MOUSER_PRICE-STOCK: https://www.mouser.co.uk/ProductDetail/STMicroelectronics/L7805CD2T-TR?qs=8tkG3v2%2F4sGtQPO74MZjHw%3D%3D; RS_PART_NUMBER: 7140657P; RS_PRICE-STOCK: http://uk.rs-online.com/web/p/products/7140657P
IC10-IC12 = IX4340N:IX4340N: IX4340 5-Ampere, Dual Low-Side MOSFET Driver Source: Datasheet <https://ms.componentsearchengine.com/Datasheets/1/IX4340N.pdf>; DESCRIPTION: IX4340 5-Ampere, Dual Low-Side MOSFET Driver; HEIGHT: 1.75mm; MANUFACTURER_NAME: IXYS SEMICONDUCTOR; MANUFACTURER_PART_NUMBER: IX4340N; MOUSER_PART_NUMBER: 849-IX4340N; MOUSER_PRICE-STOCK: https://www.mouser.com/Search/Refine.aspx?Keyword=849-IX4340N
J1-J3 = BM06B-GHS-TBT_LF__SN__N_:BM06B-GHS-TBT(LF)(SN)(N): Conn Header Gh Top 6pos 1.25mm; AVAILABILITY: Unavailable; DESCRIPTION: Connector Header Surface Mount 6 position 0.049 _1.25mm_; MF: JST Sales; MP: BM06B-GHS-TBT_LF__SN__N_; PACKAGE: None; PRICE: None
J4 = BM03B-GHS-TBT_LF__SN__N_:BM03B-GHS-TBT(LF)(SN)(N): Conn Header Gh Top 3pos 1.25mm; DESCRIPTION: Connector Header Surface Mount 3 position 0.049 _1.25mm_; DIGI-KEY_PART_NUMBER: 455-1579-1-ND; MF: JST Sales; MP: BM03B-GHS-TBT_LF__SN__N_; PACKAGE: None
J5 = SM04B-GHS-TB_LF__SN_-:SM04B-GHS-TB(LF)(SN)-: Conn Header Gh Side 4pos 1.25mm; AVAILABILITY: Unavailable; DESCRIPTION: Connector Header Surface Mount, Right Angle 4 position 0.049 _1.25mm_; MF: JST Sales; MP: SM04B-GHS-TB_LF__SN_-; PACKAGE: None; PRICE: None
J6 = SM08B-GHS-TB_LF__SN_:SM08B-GHS-TB(LF)(SN): GH Series 8 Position 1.25 mm Pitch Side Entry Shrouded Header; AVAILABILITY: Unavailable; DESCRIPTION: Connector Header Surface Mount, Right Angle 8 position 0.049 _1.25mm_; MF: JST Sales; MP: SM08B-GHS-TB_LF__SN_; PACKAGE: None; PRICE: None
J7 = BM07B-GHS-TBT_LF__SN__N_:BM07B-GHS-TBT_LF__SN__N_: CONN HEADER GH TOP 7POS 1.25MM Source: Datasheet <http://www.jst-mfg.com/product/pdf/eng/eGH.pdf>; DESCRIPTION: CONN HEADER GH TOP 7POS 1.25MM; HEIGHT: mm; MANUFACTURER_NAME: JST (JAPAN SOLDERLESS TERMINALS); MANUFACTURER_PART_NUMBER: BM07B-GHS-TBT(LF)(SN)(N)
JP1-JP3 = Connector:PINHD-1X2: PIN HEADER; CATEGORY: CONNECTOR; SUB-CATEGORY: PIN-HEADER
LED1 LED2 = 150080RS75000:150080RS75000: LED,Wurth Elektronik,150080RS75000 Wurth Elektronik 150080RS75000, WL-SMCW Series Red LED, 625 nm 2012 (0805) Clear, Rectangle Lens SMD package Source: Datasheet <https://componentsearchengine.com/Datasheets/2/150080RS75000.pdf>; DESCRIPTION: LED,Wurth Elektronik,150080RS75000 Wurth Elektronik 150080RS75000, WL-SMCW Series Red LED, 625 nm 2012 (0805) Clear, Rectangle Lens SMD package; HEIGHT: 0.8mm; MANUFACTURER_NAME: Wurth Elektronik; MANUFACTURER_PART_NUMBER: 150080RS75000; MOUSER_PART_NUMBER: 710-150080RS75000; MOUSER_PRICE-STOCK: https://www.mouser.co.uk/ProductDetail/Wurth-Elektronik/150080RS75000?qs=LlUlMxKIyB2jdCo7bnfgew%3D%3D
LED3 LED4 = 150080VS75000:150080VS75000: Wurth Elektronik WL-SMCW 570 nm Green LED, 2012 (0805) Clear SMD package Source: Datasheet <http://katalog.we-online.com/led/datasheet/150080VS75000.pdf>; DESCRIPTION: Wurth Elektronik WL-SMCW 570 nm Green LED, 2012 (0805) Clear SMD package; HEIGHT: 0.8mm; MANUFACTURER_NAME: Wurth Elektronik; MANUFACTURER_PART_NUMBER: 150080VS75000; MOUSER_PART_NUMBER: 710-150080VS75000; MOUSER_PRICE-STOCK: https://www.mouser.co.uk/ProductDetail/Wurth-Elektronik/150080VS75000?qs=LlUlMxKIyB0tGHJmO6%252B0ug%3D%3D
LED5 LED6 = WS2812B:WS2812B: Features and Benefits  * Intelligent reverse connect protection, the power supply reverse connection does not damage the IC. * The control circuit and the LED share the only power source. Control circuit and RGB chip are integrated in a package of 5050 components, form a complete control of pixel point.  * Built-in signal reshaping circuit, after wave reshaping to the next driver, ensure wave-form distortion not accumulate.  * Built-in electric reset circuit and power lost reset circuit.  * Each pixel of the three primary color can achieve 256 brightness display, completed 16777216 color full color display, and scan frequency not less than 400Hz/s.  * Cascading port transmission signal by single line.  * Any two point the distance more than 5m transmission signal without any increase circuit.  * When the refresh rate is 30fps, cascade number are not less than1024 points.  * Send data at speeds of 800Kbps.  *The color of the light were highly consistent, cost-effective. Applications  Full-color module, Full color soft lights a lamp strip. LED decorative lighting, Indoor/outdoor LED video irregular screen. General description WS2812B is a intelligent control LED light source that the control circuit and RGB chip are integrated in a package of 5050 components. It internal include intelligent digital port data latch and signal reshaping amplification drive circuit. Also include a precision internal oscillator and a 12V voltage programmable constant curre-nt control part, effectively ensuring the pixel point light color height consistent. The data transfer protocol use single NZR communication mode. After the pixel power-on reset, the DIN port receive data from controller, the first pixel collect initial 24bit data then sent to the internal data latch, the other data which reshaping by the internal signal reshaping amplification circuit sent to the next cascade pixel through the DO port. After transmission for each pixel,the signal to reduce 24bit. pixel adopt auto reshaping transmit technology, making the pixel cascade number is not limited the signal transmission, only depend on the speed of signal transmission. LED with low driving voltage, environmental protection and energy saving, high brightness, scattering angle is large, good consistency, low power, long life and other advantages. The control chip integrated in LED above becoming more simple circuit, small volume, convenient installation. Absolute Maximum Ratings Power supply voltage: VDD +3.5V..+5.3V Input voltage: VI -0.5V..VDD+0.5V based on WS2812 from https://github.com/adafruit/Adafruit-Eagle-Library
LS1 LS2 = CEM-1206S:CEM-1206S: 12 mm, 5 V, 85 dB, Through Hole, Sealed, Magnetic Audio Transducer Buzzer; AVAILABILITY: Unavailable; CUI_PURCHASE_URL: https://www.cuidevices.com/product/audio/buzzers/audio-transducers/cem-1206s?utm_source=snapeda.com&utm_medium=referral&utm_campaign=snapedaBOM; DESCRIPTION: 12 mm, 5 V, 85 dB, Through Hole, Sealed, Magnetic Audio Transducer Buzzer; MF: CUI Devices; MP: CEM-1206S; PACKAGE: TO-220 CUI Inc.; PRICE: None
Q1 Q2 Q11 Q12 = DMP3099L-7:DMP3099L-7: Diodes Inc DMP3099L-7 P-channel MOSFET Transistor, 2.9 A, -30 V, 3-Pin SOT-23 Source: Datasheet <https://www.diodes.com/assets/Datasheets/DMP3099L.pdf>; DESCRIPTION: Diodes Inc DMP3099L-7 P-channel MOSFET Transistor, 2.9 A, -30 V, 3-Pin SOT-23; HEIGHT: 1.2mm; MANUFACTURER_NAME: Diodes Inc.; MANUFACTURER_PART_NUMBER: DMP3099L-7; MOUSER_PART_NUMBER: 621-DMP3099L-7; MOUSER_PRICE-STOCK: https://www.mouser.co.uk/ProductDetail/Diodes-Incorporated/DMP3099L-7?qs=L1DZKBg7t5HhdiZT7qYxFw%3D%3D
Q3 Q14 Q15 = MMBT2222ALT1G:MMBT2222ALT1G: MMBT2222ALT1G, NPN Bipolar Transistor, 0.6 A 40 V HFE:35 300 MHz Small Signal, 3-Pin SOT-23 Source: Datasheet <http://www.onsemi.com/pub/Collateral/MMBT2222LT1-D.PDF>; DESCRIPTION: MMBT2222ALT1G, NPN Bipolar Transistor, 0.6 A 40 V HFE:35 300 MHz Small Signal, 3-Pin SOT-23; HEIGHT: 1.11mm; MANUFACTURER_NAME: ON Semiconductor; MANUFACTURER_PART_NUMBER: MMBT2222ALT1G; MOUSER_PART_NUMBER: 863-MMBT2222ALT1G; MOUSER_PRICE-STOCK: https://www.mouser.co.uk/ProductDetail/ON-Semiconductor/MMBT2222ALT1G?qs=HVbQlW5zcXWwnD7Jokybqg%3D%3D
Q4 Q6 Q8 = DMP4010SK3Q-13:DMP4010SK3Q-13: MOSFET MOSFET BVDSS: Source: Datasheet <https://www.diodes.com/assets/Datasheets/DMP4010SK3Q.pdf>; DESCRIPTION: MOSFET MOSFET BVDSS:; HEIGHT: 2.39mm; MANUFACTURER_NAME: Diodes Inc.; MANUFACTURER_PART_NUMBER: DMP4010SK3Q-13; MOUSER_PART_NUMBER: 621-DMP4010SK3Q-13; MOUSER_PRICE-STOCK: https://www.mouser.co.uk/ProductDetail/Diodes-Incorporated/DMP4010SK3Q-13?qs=j1jvDfvplqJZnZw5VzpQGw%3D%3D
Q5 Q7 Q9 Q10 Q13 = DMN6140LQ-7:DMN6140LQ-7: MOSFET 60V N-Ch Enh FET 60Vdss 20Vgss 10A Source: Datasheet <https://www.diodes.com/assets/Datasheets/DMN6140LQ.pdf>; DESCRIPTION: MOSFET 60V N-Ch Enh FET 60Vdss 20Vgss 10A; HEIGHT: 1.1mm; MANUFACTURER_NAME: Diodes Inc.; MANUFACTURER_PART_NUMBER: DMN6140LQ-7; MOUSER_PART_NUMBER: 621-DMN6140LQ-7; MOUSER_PRICE-STOCK: https://www.mouser.co.uk/ProductDetail/Diodes-Incorporated/DMN6140LQ-7?qs=wtVJq%252Be05r%252B05hOLE8kNlg%3D%3D
R1-R40 = Resistor:R: Resistor Fixed - Generic; CATEGORY: Resistor; SUB-CATEGORY: Fixed
SH1-SH4 = shorts-old:SHORT-H: Short between two nets; BOM: no
U1 = Teensy_3_and_LC_Series_Boards_v1.4:TEENSY_3.6_ALL_PINS: All PIN version of the Teensy 3.6.
U2 = Arduino_Nano_3:ARDUINO_NANO_3: CLOCK SAW OSCILLATOR SEAM7050 T&; AVAILABILITY: Unavailable; DESCRIPTION: ATmega328 Arduino Nano AVR® ATmega AVR MCU 8-Bit Embedded Evaluation Board; MF: Arduino; MP: A000005; PACKAGE: None; PRICE: None
U3 = RFM98W-433S2:RFM98W-433S2: RFM98W LoRa Transceiver Module 433MHz; AVAILABILITY: Unavailable; DESCRIPTION: 802.15.4, General ISM < 1GHz LoRa™ Transceiver Module 433MHz Surface Mount; MF: RF Solutions; MP: RFM98W-433S2; PACKAGE: SMD-16 RF Solutions; PRICE: None
Z1 Z2 = MM3Z3V0ST1G:MM3Z3V0ST1G: Zener Diodes ZENER DIODE 200 MW 3.0 V Source: Datasheet <https://componentsearchengine.com/Datasheets/1/MM3Z3V0ST1G.pdf>; DESCRIPTION: Zener Diodes ZENER DIODE 200 MW 3.0 V; HEIGHT: 1.1mm; MANUFACTURER_NAME: ON Semiconductor; MANUFACTURER_PART_NUMBER: MM3Z3V0ST1G; MOUSER_PART_NUMBER: 863-MM3Z3V0ST1G; MOUSER_PRICE-STOCK: https://www.mouser.co.uk/ProductDetail/ON-Semiconductor/MM3Z3V0ST1G?qs=ZbcYFwcEkbcQGEmg6wDNLA%3D%3D